# EasyEDA schematic ESP32_fire.json

## Sheets
1 Sheet_1: TITLE: Sheet_1; REV: 1.0; Date: 2021-04-05; Sheet: 1/1; Drawn By: feo220; Company: Your Company
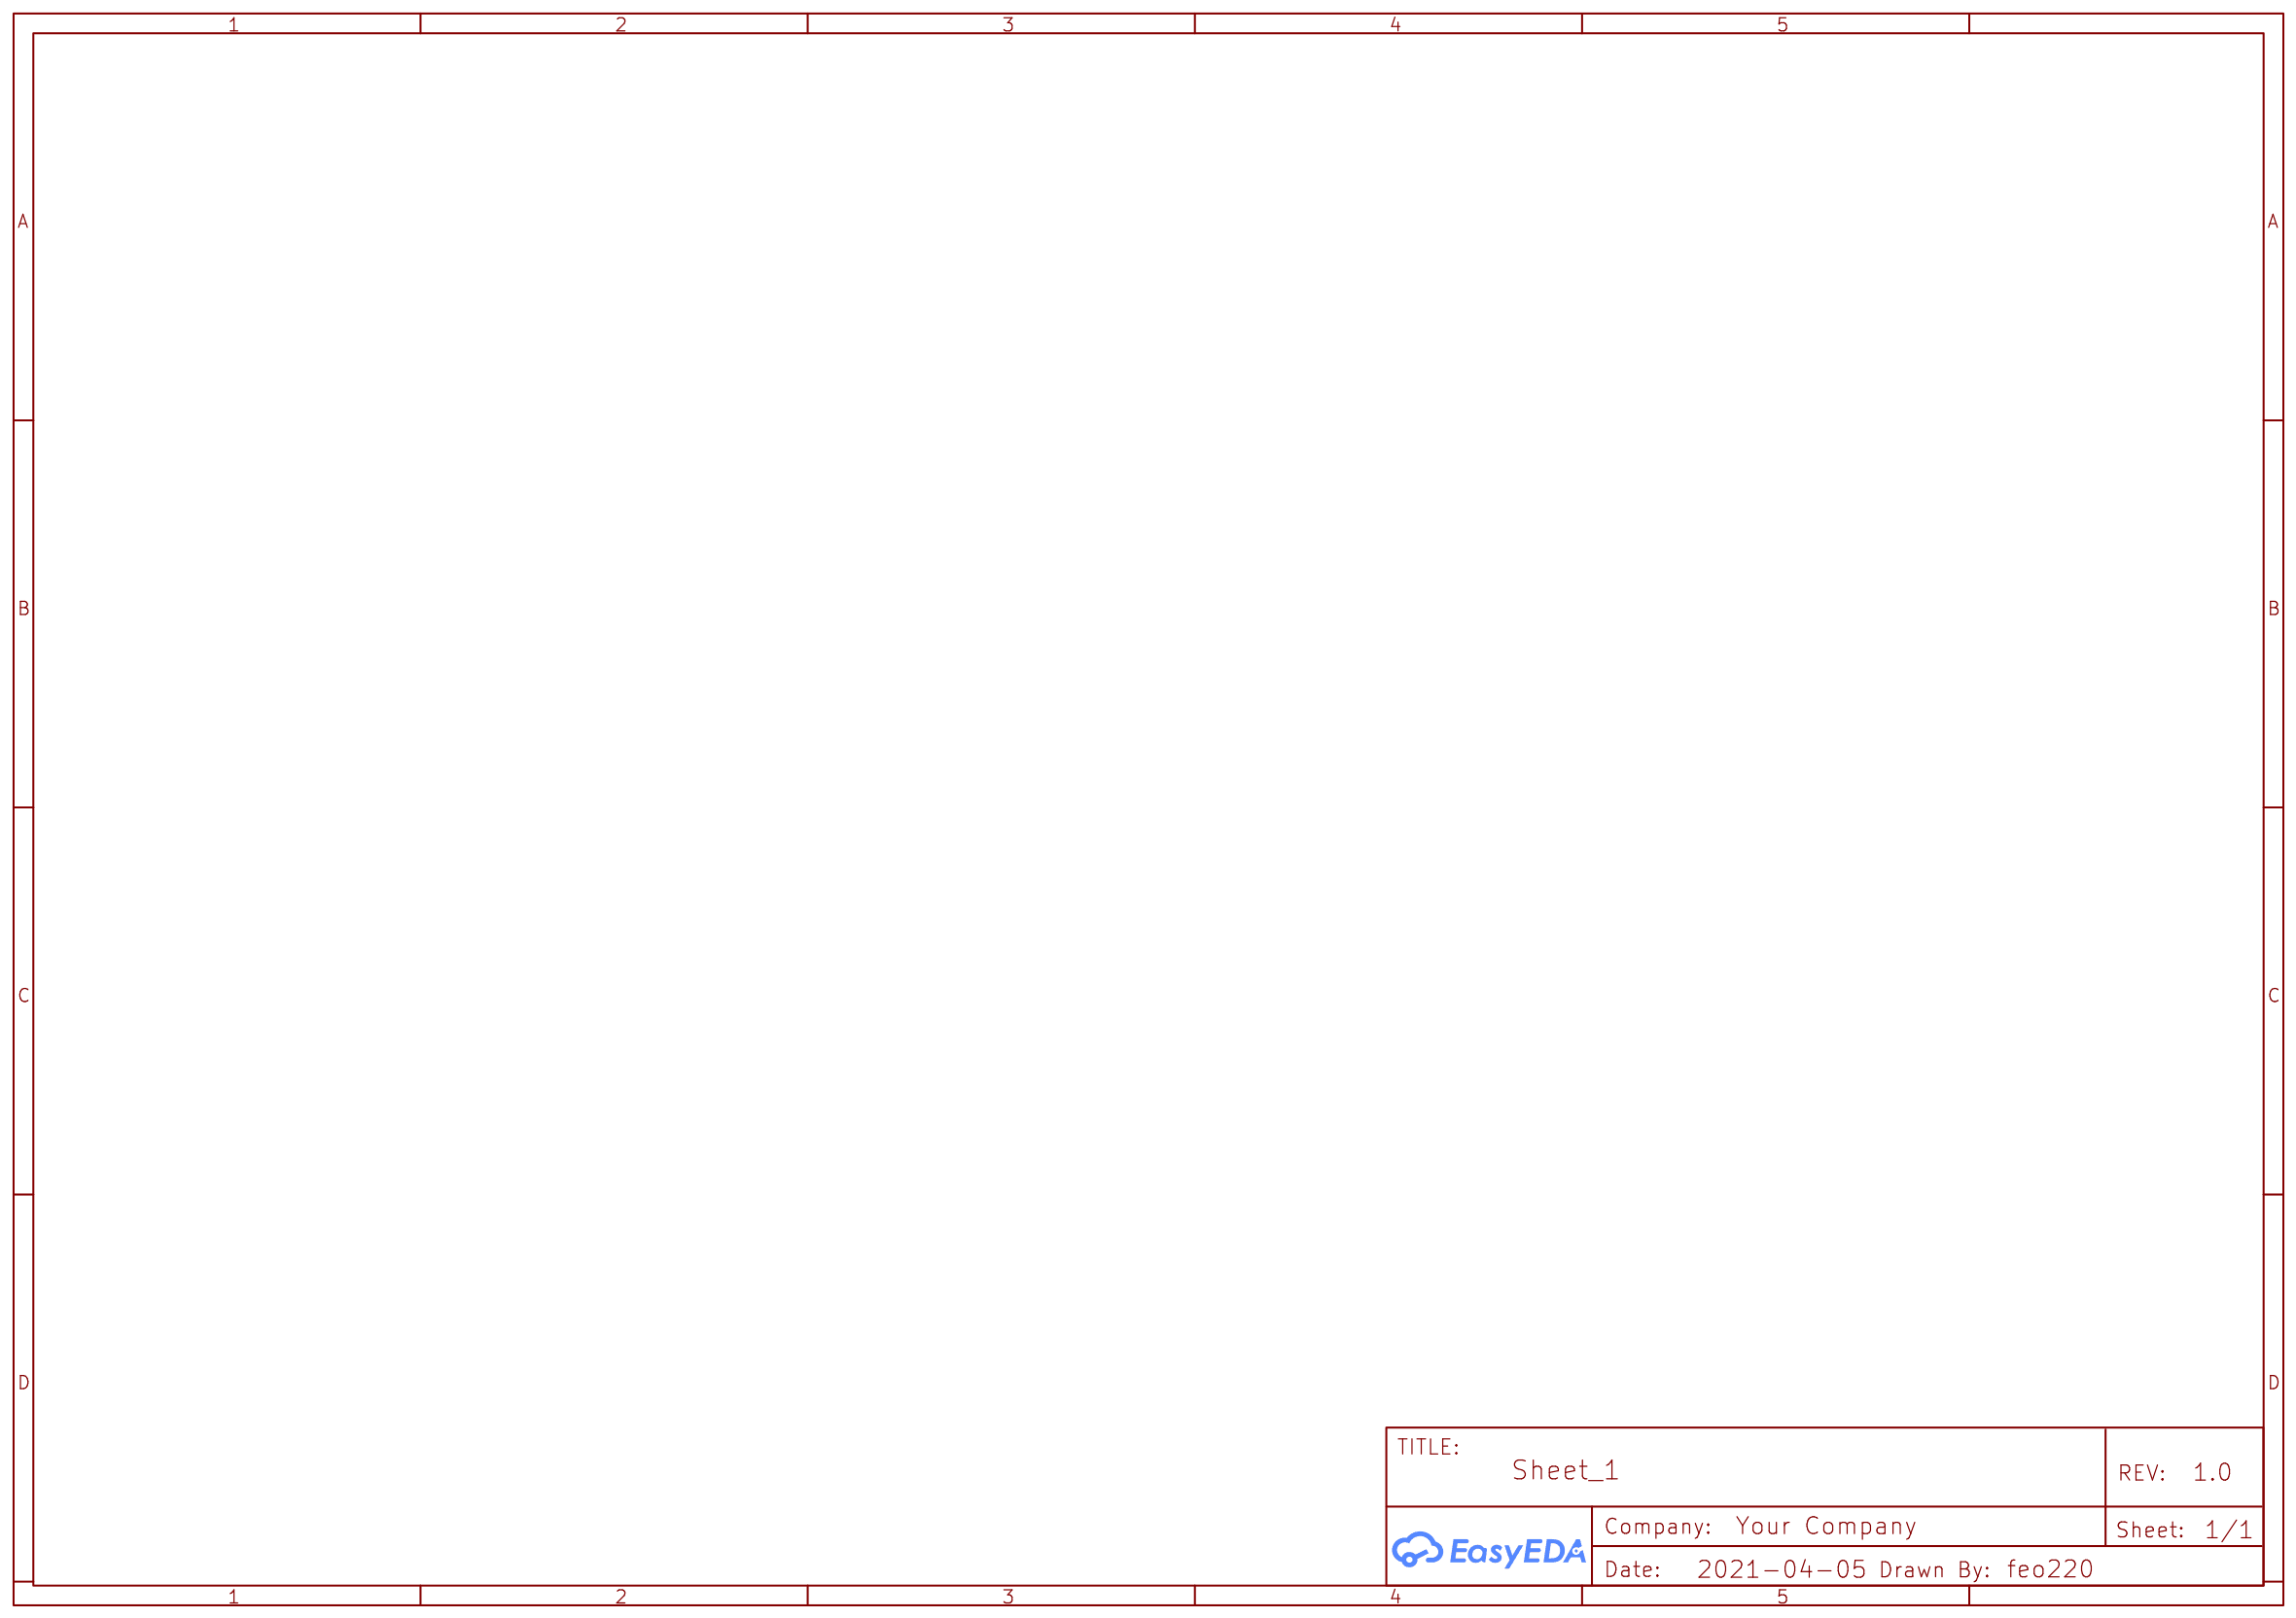
[diagram p0: Sheet_1]
2 Sheet_2: TITLE: Sheet_2
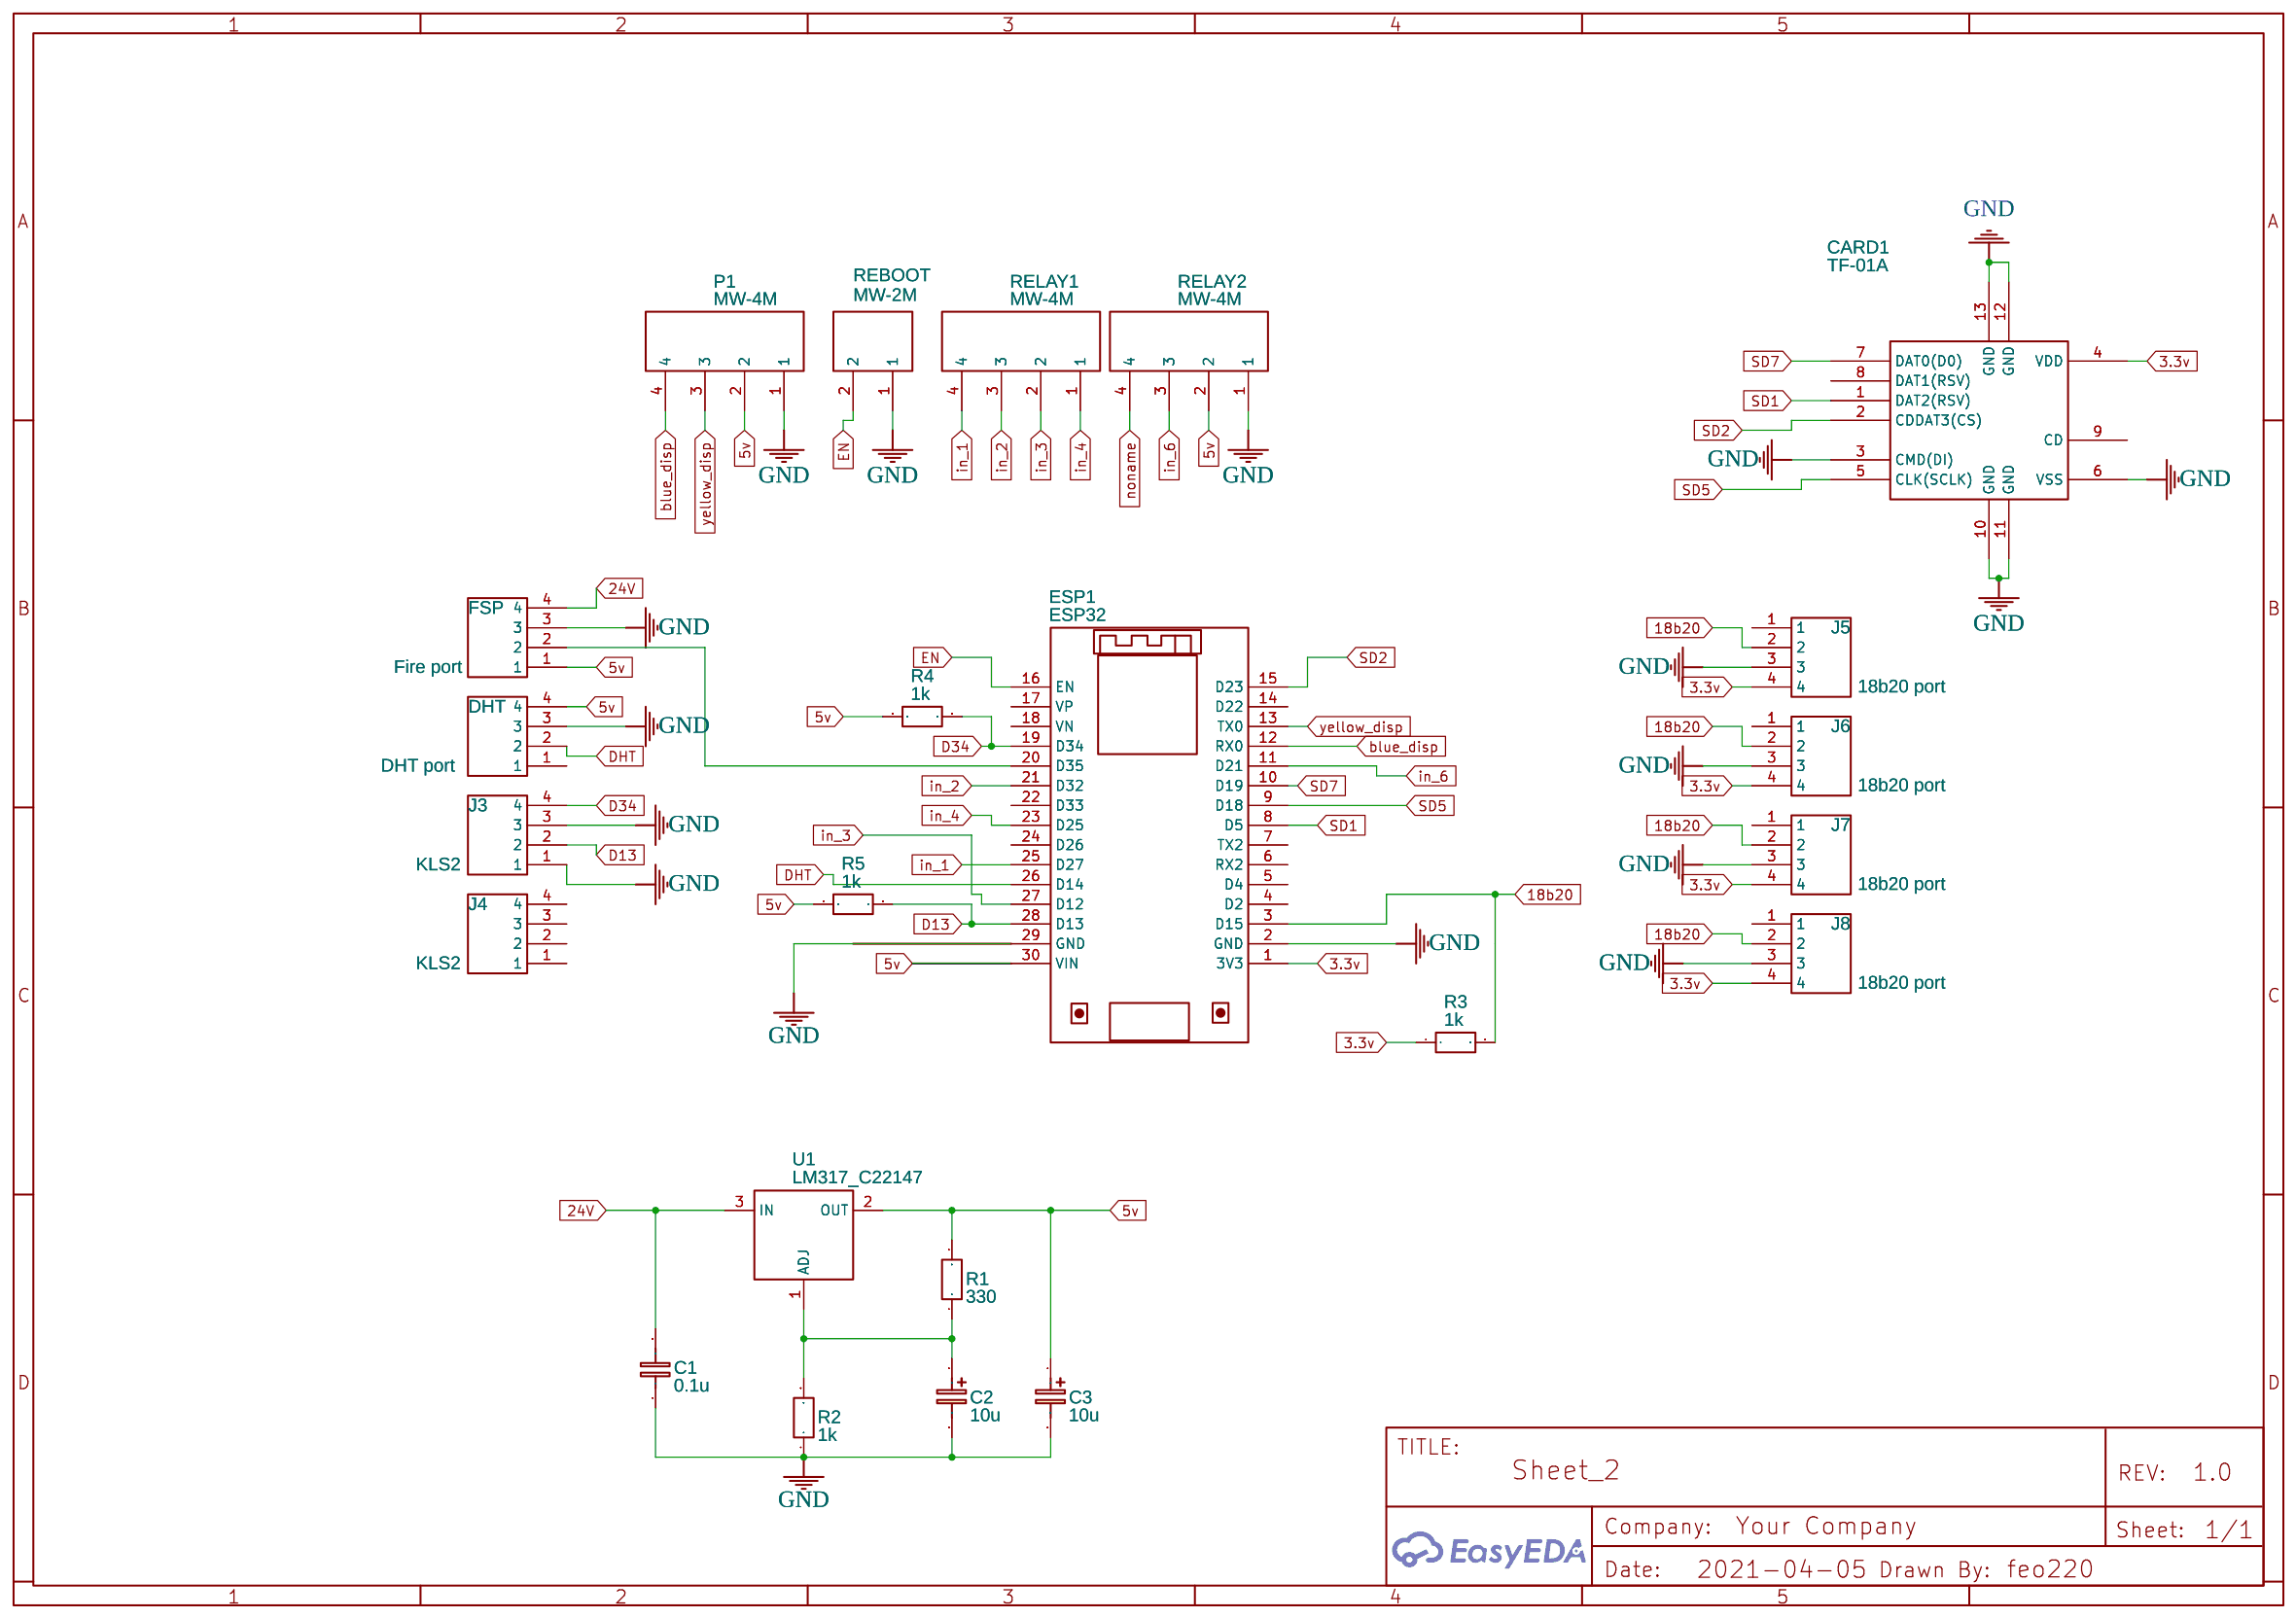
[diagram p1: Sheet_2]

## Parts
C1  0.1u  [RAD-0.2]
C2  10u  [CAP-D5.0-F2.0]
C3  10u  [CAP-D5.0-F2.0]
CARD1  TF-01A  [TF-SMD_TF-01A]
DHT  DHT port  [KLS2-103-5.00-04P-4S]
ESP1  ESP32  [ESP32 DEV KIT 30 PINS]
FSP  Fire port  [KLS2-103-5.00-04P-4S]
J3  KLS2  [KLS2-103-5.00-04P-4S]
J4  KLS2  [KLS2-103-5.00-04P-4S]
J5  18b20 port  [KLS2-103-5.00-04P-4S]
J6  18b20 port  [KLS2-103-5.00-04P-4S]
J7  18b20 port  [KLS2-103-5.00-04P-4S]
J8  18b20 port  [KLS2-103-5.00-04P-4S]
P1  MW-4M  [MW-4M]
R1  330  [RES-TH_BD2.3-L6.5-P10.50-D0.5]
R2  1k  [RES-TH_BD2.3-L6.5-P10.50-D0.5]
R3  1k  [R0603]
R4  1k  [R0603]
R5  1k  [R0603]
REBOOT  MW-2M  [MW-2M-OK]
RELAY1  MW-4M  [MW-4M]
RELAY2  MW-4M  [MW-4M]
U1  LM317_C22147  [TO-220-3_L10.0-W4.5-P2.54-L]

## Library data of the parts
C1 = C_0603_EU: Contributor: LCEDA_Lib
C2 C3 = C_Tan_SMD_A_EU: Contributor: LCEDA_Lib
CARD1 = TF-01A: Supplier: LCSC; Manufacturer: HRO; Supplier Part: C91145
DHT FSP J3-J8 = KLS2-103-5.00-04P-4S: Supplier: ChipiDip; Contributor: tervladimir
ESP1 = ESP32: Manufacturer Part: ESP32-DEVKIT-C; Contributor: bonnel
P1 RELAY1 RELAY2 = MW-4M: Manufacturer Part: DG306-5.0-02P-12-00A(H); link: http://files.клеммник.рф/pdf/dg306-5.0.pdf; Contributor: Victorcher1972
R1-R5 = R_0603_EU: Contributor: LCEDA_Lib
REBOOT = MW-2M: Manufacturer Part: DG306-5.0-02P-12-00A(H); link: http://files.клеммник.рф/pdf/dg306-5.0.pdf; Contributor: sigarevsv
U1 = LM317_C22147: Supplier: LCSC; Manufacturer: CJ; Manufacturer Part: LM317; Supplier Part: C22147; Contributor: 立创EDA官方封装库; LCSC Assembly: Yes; SMT Type: Extend; Paste Type: expand

## Nets
3.3v: CARD1.4(VDD) ESP1.1(3V3) J5.4 J6.4 J7.4 J8.4 R3.1
5v: C3.1 DHT.4 ESP1.30(VIN) FSP.1 P1.2 R1.2 R4.1 R5.1 RELAY2.2 U1.2(OUT)
24V: C1.2 FSP.4 U1.3(IN)
GND: C1.1 C2.2 C3.2 CARD1.3(CMD(DI)) CARD1.6(VSS) CARD1.10(GND) CARD1.11(GND) CARD1.12(GND) CARD1.13(GND) DHT.3 ESP1.2(GND) ESP1.29(GND) FSP.3 J3.1 J3.3 J5.3 J6.3 J7.3 J8.3 P1.1 R2.1 REBOOT.1 RELAY2.1
18b20: ESP1.3(D15) J5.2 J6.2 J7.2 J8.2 R3.2
blue_disp: ESP1.12(RX0) P1.4
D13: ESP1.28(D13) J3.2 R5.2
D34: ESP1.19(D34) J3.4 R4.2
DHT: DHT.2 ESP1.26(D14)
EN: ESP1.16(EN) REBOOT.2
in_1: ESP1.25(D27) RELAY1.4
in_2: ESP1.21(D32) RELAY1.3
in_3: ESP1.27(D12) RELAY1.2
in_4: ESP1.23(D25) RELAY1.1
in_6: ESP1.11(D21) RELAY2.3
noname: RELAY2.4
SD1: CARD1.1(DAT2(RSV)) ESP1.8(D5)
SD2: CARD1.2(CDDAT3(CS)) ESP1.15(D23)
SD5: CARD1.5(CLK(SCLK)) ESP1.9(D18)
SD7: CARD1.7(DAT0(D0)) ESP1.10(D19)
yellow_disp: ESP1.13(TX0) P1.3
Net-(C2-1): C2.1 R1.1 R2.2 U1.1(ADJ)
Net-(ESP1-20): ESP1.20(D35) FSP.2

Not connected (* = marked no-connect by the designer): CARD1 8(DAT1(RSV)) 9(CD); DHT 1; ESP1 4(D2) 5(D4) 6(RX2) 7(TX2) 14(D22) 17(VP) 18(VN) 22(D33) 24(D26); J4 1 2 3 4; J5 1; J6 1; J7 1; J8 1
